# Altium schematic sheet 继电器.SchDoc
size A3
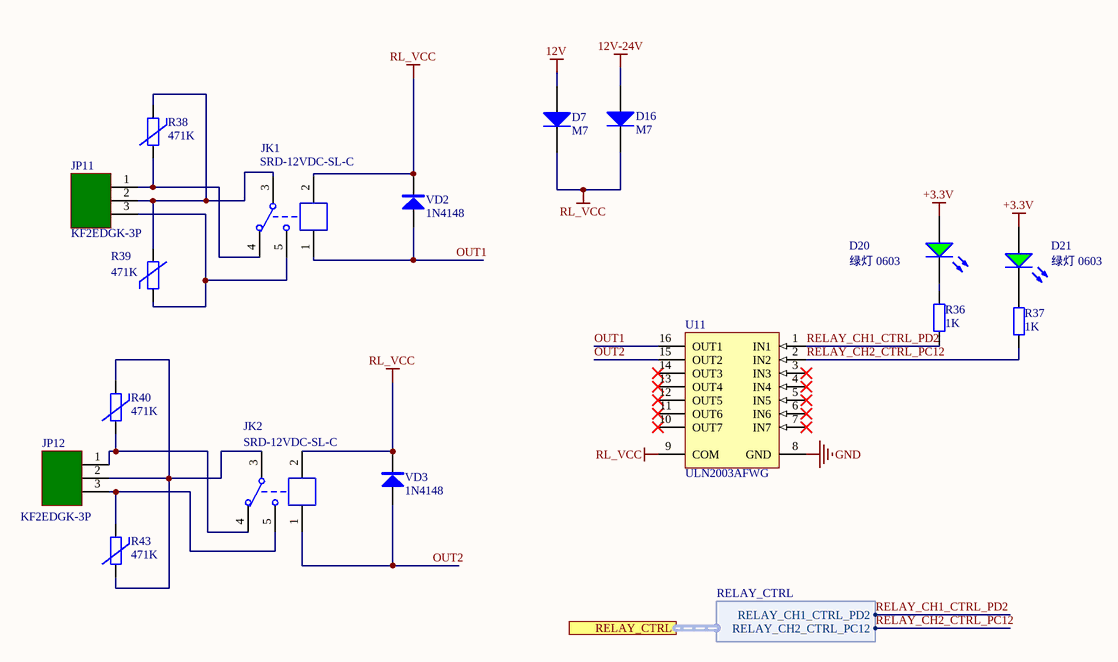
[diagram p0: 继电器.SchDoc]

## Parts
D7  M7  [SMA(DO-214AC)_S1]
D16  M7  [SMA(DO-214AC)_S1]
D20  绿灯 0603  [0603_LED_S1]
D21  绿灯 0603  [0603_LED_S1]
JK1  SRD-12VDC-SL-C  [SRD-C_B]
JK2  SRD-12VDC-SL-C  [SRD-C_B]
JP11  KF2EDGK-3P  [KF2EDGK5.08W-3P]
JP12  KF2EDGK-3P  [KF2EDGK5.08W-3P]
R36  1K  [0603_R]
R37  1K  [0603_R]
R38  471K  [VDR 9D-4.5]
R39  471K  [VDR 9D-4.5]
R40  471K  [VDR 9D-4.5]
R43  471K  [VDR 9D-4.5]
U11  ULN2003AFWG  [SOIC-16_150mil]
VD2  1N4148  [MINI_MELF (LL34)]
VD3  1N4148  [MINI_MELF (LL34)]

## Ports
RELAY_CTRL (harness RELAY_CTRL)

## Harnesses
RELAY_CTRL: RELAY_CH1_CTRL_PD2, RELAY_CH2_CTRL_PC12

## Nets
12V: D7.1(A)
12V-24V: D16.1(A)
+3.3V: D20.A D21.A
GND: U11.8(GND)
RL_VCC: D7.2(K) D16.2(K) JK1.2 JK2.2 U11.9(COM) VD2.2(K) VD3.2(K)
OUT1: JK1.1 U11.16(OUT1) VD2.1(A)
OUT2: JK2.1 U11.15(OUT2) VD3.1(A)
RELAY_CH1_CTRL_PD2: R36.1 U11.1(IN1) ; port RELAY_CTRL.RELAY_CH1_CTRL_PD2
RELAY_CH2_CTRL_PC12: R37.1 U11.2(IN2) ; port RELAY_CTRL.RELAY_CH2_CTRL_PC12
NetD20_K: D20.K R36.2
NetD21_K: D21.K R37.2
NetJK1_3: JK1.3 JP11.2 R38.1 R39.2
NetJK1_4: JK1.4 JP11.1 R38.2
NetJK1_5: JK1.5 JP11.3 R39.1
NetJK2_3: JK2.3 JP12.2 R40.1 R43.2
NetJK2_4: JK2.4 JP12.1 R40.2
NetJK2_5: JK2.5 JP12.3 R43.1

Not connected (* = marked no-connect by the designer): U11 3(IN3)* 4(IN4)* 5(IN5)* 6(IN6)* 7(IN7)* 10(OUT7)* 11(OUT6)* 12(OUT5)* 13(OUT4)* 14(OUT3)*

## Library data of the parts
D7 D16 = SMA(DO-214AC) M7: 二极管; 备注: 1N4007 4007 编号C2464 已经停售, 使用新物料编号C95872; ComponentLink1Description: 供应商链接; ComponentLink1URL: http://www.szlcsc.com/product/details_2841.html; Package: SMA(DO-214AC); Supplier: LC; SuppliersPartNumber: C95872
D20 D21 = 0603 绿灯: 发光二极管; ComponentLink1Description: 供应商链接; ComponentLink1URL: http://www.szlcsc.com/product/details_73152.html; Package: 0603; Supplier: LC; SuppliersPartNumber: C72043
JK1 JK2 = SRD-12VDC-SL-C: 12V单路双控继电器; BOM名称: 12V继电器; 版权归属: 源创客; 学习资源: www.ooocke.com
R36 R37 = 0603 510Ω (5100) 1%: 贴片电阻; ComponentLink1Description: 供应商链接; ComponentLink1URL: http://www.szlcsc.com/product/details_23920.html; Package: 0603; Supplier: LC; SuppliersPartNumber: C23193
R38-R40 R43 = R_VDR: 压敏电阻; 版权归属: 源创客; BOM名称: 压敏电阻; 学习资源: www.ooocke.com
U11 = ULN2003AFWG: 大电流驱动; ComponentLink1Description: 供应商链接; ComponentLink1URL: http://www.szlcsc.com/product/details_5880.html; Package: SOIC-16_150mil; Supplier: LC; SuppliersPartNumber: C5437
VD2 VD3 = 1N4148: 高速开关二极管; 版权归属: 源创客; BOM名称: 高速开关二极管; 学习资源: www.ooocke.com